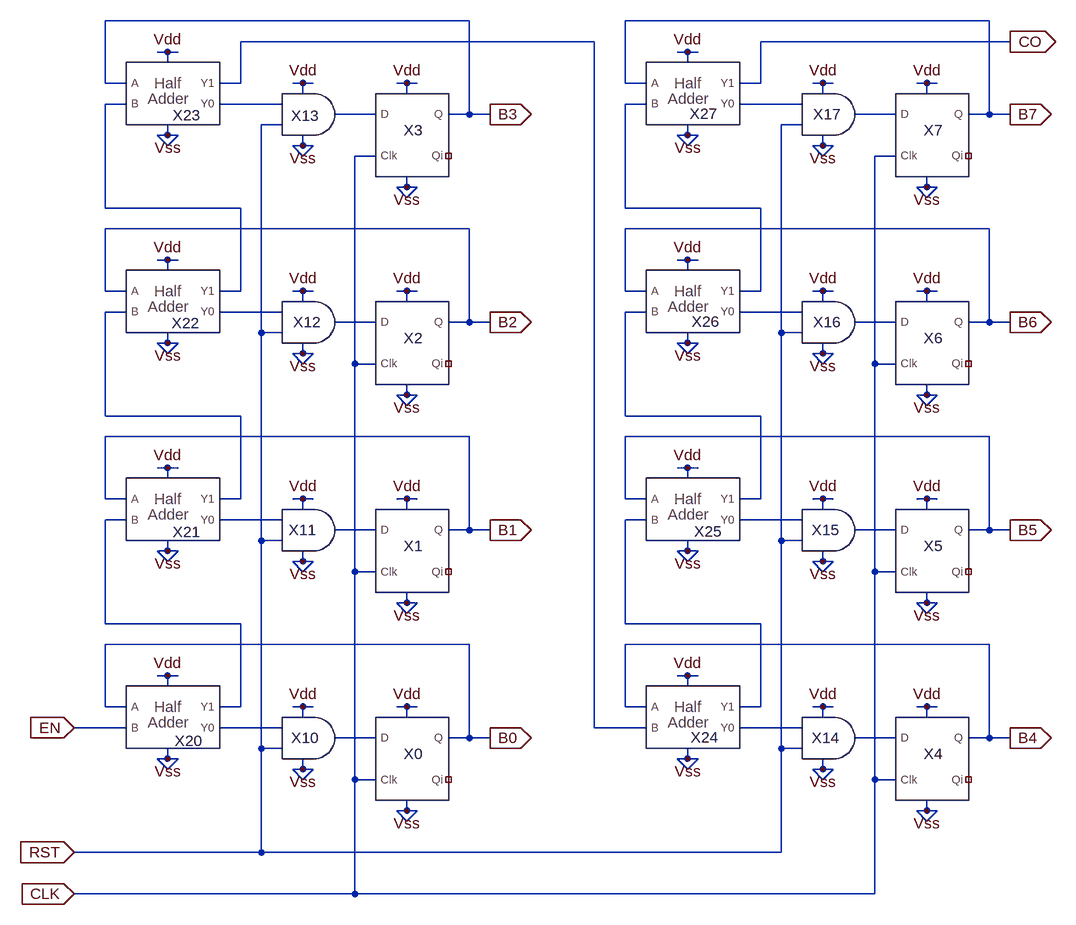
[diagram p0: schematic 8bitcounter.asc]
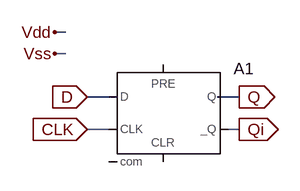
[diagram p1: sub-circuit dff.asc]
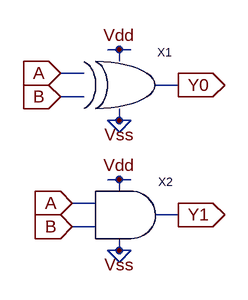
[diagram p2: sub-circuit halfadder.asc]
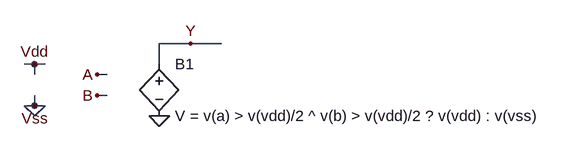
[diagram p3: sub-circuit xor.asc]
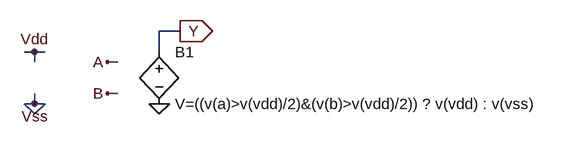
[diagram p4: sub-circuit and.asc]
8bitcounter.asc, the LTspice schematic file:
Version 4
SHEET 1 1380 680
WIRE 448 -960 -112 -960
WIRE 1248 -960 688 -960
WIRE 640 -928 96 -928
WIRE 1280 -928 896 -928
WIRE -16 -912 -32 -912
WIRE 0 -912 -16 -912
WIRE 784 -912 768 -912
WIRE 800 -912 784 -912
WIRE -16 -896 -16 -912
WIRE 784 -896 784 -912
WIRE -112 -864 -112 -960
WIRE -80 -864 -112 -864
WIRE 96 -864 96 -928
WIRE 96 -864 64 -864
WIRE 192 -864 176 -864
WIRE 208 -864 192 -864
WIRE 352 -864 336 -864
WIRE 368 -864 352 -864
WIRE 688 -864 688 -960
WIRE 720 -864 688 -864
WIRE 896 -864 896 -928
WIRE 896 -864 864 -864
WIRE 992 -864 976 -864
WIRE 1008 -864 992 -864
WIRE 1152 -864 1136 -864
WIRE 1168 -864 1152 -864
WIRE 192 -848 192 -864
WIRE 352 -848 352 -864
WIRE 992 -848 992 -864
WIRE 1152 -848 1152 -864
WIRE -80 -832 -112 -832
WIRE 160 -832 64 -832
WIRE 720 -832 688 -832
WIRE 960 -832 864 -832
WIRE 304 -816 240 -816
WIRE 448 -816 448 -960
WIRE 448 -816 416 -816
WIRE 480 -816 448 -816
WIRE 1104 -816 1040 -816
WIRE 1248 -816 1248 -960
WIRE 1248 -816 1216 -816
WIRE 1280 -816 1248 -816
WIRE 160 -800 128 -800
WIRE 960 -800 928 -800
WIRE -16 -784 -16 -800
WIRE -16 -784 -32 -784
WIRE 0 -784 -16 -784
WIRE 784 -784 784 -800
WIRE 784 -784 768 -784
WIRE 800 -784 784 -784
WIRE -16 -768 -32 -784
WIRE -16 -768 0 -784
WIRE 192 -768 192 -784
WIRE 192 -768 176 -768
WIRE 208 -768 192 -768
WIRE 784 -768 768 -784
WIRE 784 -768 800 -784
WIRE 992 -768 992 -784
WIRE 992 -768 976 -768
WIRE 1008 -768 992 -768
WIRE 192 -752 176 -768
WIRE 192 -752 208 -768
WIRE 304 -752 272 -752
WIRE 992 -752 976 -768
WIRE 992 -752 1008 -768
WIRE 1104 -752 1072 -752
WIRE 352 -704 352 -720
WIRE 352 -704 336 -704
WIRE 368 -704 352 -704
WIRE 1152 -704 1152 -720
WIRE 1152 -704 1136 -704
WIRE 1168 -704 1152 -704
WIRE 352 -688 336 -704
WIRE 352 -688 368 -704
WIRE 1152 -688 1136 -704
WIRE 1152 -688 1168 -704
WIRE -112 -672 -112 -832
WIRE 96 -672 -112 -672
WIRE 688 -672 688 -832
WIRE 896 -672 688 -672
WIRE 448 -640 -112 -640
WIRE 1248 -640 688 -640
WIRE -16 -592 -32 -592
WIRE 0 -592 -16 -592
WIRE 784 -592 768 -592
WIRE 800 -592 784 -592
WIRE -16 -576 -16 -592
WIRE 784 -576 784 -592
WIRE -112 -544 -112 -640
WIRE -80 -544 -112 -544
WIRE 96 -544 96 -672
WIRE 96 -544 64 -544
WIRE 192 -544 176 -544
WIRE 208 -544 192 -544
WIRE 352 -544 336 -544
WIRE 368 -544 352 -544
WIRE 688 -544 688 -640
WIRE 720 -544 688 -544
WIRE 896 -544 896 -672
WIRE 896 -544 864 -544
WIRE 992 -544 976 -544
WIRE 1008 -544 992 -544
WIRE 1152 -544 1136 -544
WIRE 1168 -544 1152 -544
WIRE 192 -528 192 -544
WIRE 352 -528 352 -544
WIRE 992 -528 992 -544
WIRE 1152 -528 1152 -544
WIRE -80 -512 -112 -512
WIRE 160 -512 64 -512
WIRE 720 -512 688 -512
WIRE 960 -512 864 -512
WIRE 304 -496 240 -496
WIRE 448 -496 448 -640
WIRE 448 -496 416 -496
WIRE 480 -496 448 -496
WIRE 1104 -496 1040 -496
WIRE 1248 -496 1248 -640
WIRE 1248 -496 1216 -496
WIRE 1280 -496 1248 -496
WIRE 128 -480 128 -800
WIRE 160 -480 128 -480
WIRE 928 -480 928 -800
WIRE 960 -480 928 -480
WIRE -16 -464 -16 -480
WIRE -16 -464 -32 -464
WIRE 0 -464 -16 -464
WIRE 784 -464 784 -480
WIRE 784 -464 768 -464
WIRE 800 -464 784 -464
WIRE -16 -448 -32 -464
WIRE -16 -448 0 -464
WIRE 192 -448 192 -464
WIRE 192 -448 176 -448
WIRE 208 -448 192 -448
WIRE 784 -448 768 -464
WIRE 784 -448 800 -464
WIRE 992 -448 992 -464
WIRE 992 -448 976 -448
WIRE 1008 -448 992 -448
WIRE 192 -432 176 -448
WIRE 192 -432 208 -448
WIRE 272 -432 272 -752
WIRE 304 -432 272 -432
WIRE 992 -432 976 -448
WIRE 992 -432 1008 -448
WIRE 1072 -432 1072 -752
WIRE 1104 -432 1072 -432
WIRE 352 -384 352 -400
WIRE 352 -384 336 -384
WIRE 368 -384 352 -384
WIRE 1152 -384 1152 -400
WIRE 1152 -384 1136 -384
WIRE 1168 -384 1152 -384
WIRE 352 -368 336 -384
WIRE 352 -368 368 -384
WIRE 1152 -368 1136 -384
WIRE 1152 -368 1168 -384
WIRE -112 -352 -112 -512
WIRE 96 -352 -112 -352
WIRE 688 -352 688 -512
WIRE 896 -352 688 -352
WIRE 448 -320 -112 -320
WIRE 1248 -320 688 -320
WIRE -16 -272 -32 -272
WIRE 0 -272 -16 -272
WIRE 784 -272 768 -272
WIRE 800 -272 784 -272
WIRE -16 -256 -16 -272
WIRE 784 -256 784 -272
WIRE -112 -224 -112 -320
WIRE -80 -224 -112 -224
WIRE 96 -224 96 -352
WIRE 96 -224 64 -224
WIRE 192 -224 176 -224
WIRE 208 -224 192 -224
WIRE 352 -224 336 -224
WIRE 368 -224 352 -224
WIRE 688 -224 688 -320
WIRE 720 -224 688 -224
WIRE 896 -224 896 -352
WIRE 896 -224 864 -224
WIRE 992 -224 976 -224
WIRE 1008 -224 992 -224
WIRE 1152 -224 1136 -224
WIRE 1168 -224 1152 -224
WIRE 192 -208 192 -224
WIRE 352 -208 352 -224
WIRE 992 -208 992 -224
WIRE 1152 -208 1152 -224
WIRE -80 -192 -112 -192
WIRE 160 -192 64 -192
WIRE 720 -192 688 -192
WIRE 960 -192 864 -192
WIRE 304 -176 240 -176
WIRE 448 -176 448 -320
WIRE 448 -176 416 -176
WIRE 480 -176 448 -176
WIRE 1104 -176 1040 -176
WIRE 1248 -176 1248 -320
WIRE 1248 -176 1216 -176
WIRE 1280 -176 1248 -176
WIRE 128 -160 128 -480
WIRE 160 -160 128 -160
WIRE 928 -160 928 -480
WIRE 960 -160 928 -160
WIRE -16 -144 -16 -160
WIRE -16 -144 -32 -144
WIRE 0 -144 -16 -144
WIRE 784 -144 784 -160
WIRE 784 -144 768 -144
WIRE 800 -144 784 -144
WIRE -16 -128 -32 -144
WIRE -16 -128 0 -144
WIRE 192 -128 192 -144
WIRE 192 -128 176 -128
WIRE 208 -128 192 -128
WIRE 784 -128 768 -144
WIRE 784 -128 800 -144
WIRE 992 -128 992 -144
WIRE 992 -128 976 -128
WIRE 1008 -128 992 -128
WIRE 192 -112 176 -128
WIRE 192 -112 208 -128
WIRE 272 -112 272 -432
WIRE 304 -112 272 -112
WIRE 992 -112 976 -128
WIRE 992 -112 1008 -128
WIRE 1072 -112 1072 -432
WIRE 1104 -112 1072 -112
WIRE 352 -64 352 -80
WIRE 352 -64 336 -64
WIRE 368 -64 352 -64
WIRE 1152 -64 1152 -80
WIRE 1152 -64 1136 -64
WIRE 1168 -64 1152 -64
WIRE 352 -48 336 -64
WIRE 352 -48 368 -64
WIRE 1152 -48 1136 -64
WIRE 1152 -48 1168 -64
WIRE -112 -32 -112 -192
WIRE 96 -32 -112 -32
WIRE 688 -32 688 -192
WIRE 896 -32 688 -32
WIRE 448 0 -112 0
WIRE 1248 0 688 0
WIRE -16 48 -32 48
WIRE 0 48 -16 48
WIRE 784 48 768 48
WIRE 800 48 784 48
WIRE -16 64 -16 48
WIRE 784 64 784 48
WIRE -112 96 -112 0
WIRE -80 96 -112 96
WIRE 96 96 96 -32
WIRE 96 96 64 96
WIRE 192 96 176 96
WIRE 208 96 192 96
WIRE 352 96 336 96
WIRE 368 96 352 96
WIRE 688 96 688 0
WIRE 720 96 688 96
WIRE 896 96 896 -32
WIRE 896 96 864 96
WIRE 992 96 976 96
WIRE 1008 96 992 96
WIRE 1152 96 1136 96
WIRE 1168 96 1152 96
WIRE 192 112 192 96
WIRE 352 112 352 96
WIRE 992 112 992 96
WIRE 1152 112 1152 96
WIRE -80 128 -160 128
WIRE 160 128 64 128
WIRE 640 128 640 -928
WIRE 720 128 640 128
WIRE 960 128 864 128
WIRE 304 144 240 144
WIRE 448 144 448 0
WIRE 448 144 416 144
WIRE 480 144 448 144
WIRE 1104 144 1040 144
WIRE 1248 144 1248 0
WIRE 1248 144 1216 144
WIRE 1280 144 1248 144
WIRE 128 160 128 -160
WIRE 160 160 128 160
WIRE 928 160 928 -160
WIRE 960 160 928 160
WIRE -16 176 -16 160
WIRE -16 176 -32 176
WIRE 0 176 -16 176
WIRE 784 176 784 160
WIRE 784 176 768 176
WIRE 800 176 784 176
WIRE -16 192 -32 176
WIRE -16 192 0 176
WIRE 192 192 192 176
WIRE 192 192 176 192
WIRE 208 192 192 192
WIRE 784 192 768 176
WIRE 784 192 800 176
WIRE 992 192 992 176
WIRE 992 192 976 192
WIRE 1008 192 992 192
WIRE 192 208 176 192
WIRE 192 208 208 192
WIRE 272 208 272 -112
WIRE 304 208 272 208
WIRE 992 208 976 192
WIRE 992 208 1008 192
WIRE 1072 208 1072 -112
WIRE 1104 208 1072 208
WIRE 352 256 352 240
WIRE 352 256 336 256
WIRE 368 256 352 256
WIRE 1152 256 1152 240
WIRE 1152 256 1136 256
WIRE 1168 256 1152 256
WIRE 352 272 336 256
WIRE 352 272 368 256
WIRE 1152 272 1136 256
WIRE 1152 272 1168 256
WIRE 128 320 128 160
WIRE 128 320 -160 320
WIRE 928 320 928 160
WIRE 928 320 128 320
WIRE 272 384 272 208
WIRE 272 384 -160 384
WIRE 1072 384 1072 208
WIRE 1072 384 272 384
FLAG 352 96 Vdd
FLAG 352 256 Vss
FLAG 192 96 Vdd
FLAG -16 48 Vdd
FLAG 192 192 Vss
FLAG -16 176 Vss
FLAG 480 144 B0
IOPIN 480 144 Out
FLAG 352 -224 Vdd
FLAG 352 -64 Vss
FLAG 192 -224 Vdd
FLAG -16 -272 Vdd
FLAG 192 -128 Vss
FLAG -16 -144 Vss
FLAG 480 -176 B1
IOPIN 480 -176 Out
FLAG 352 -544 Vdd
FLAG 352 -384 Vss
FLAG 192 -544 Vdd
FLAG -16 -592 Vdd
FLAG 192 -448 Vss
FLAG -16 -464 Vss
FLAG 480 -496 B2
IOPIN 480 -496 Out
FLAG 352 -864 Vdd
FLAG 352 -704 Vss
FLAG 192 -864 Vdd
FLAG -16 -912 Vdd
FLAG 192 -768 Vss
FLAG -16 -784 Vss
FLAG 480 -816 B3
IOPIN 480 -816 Out
FLAG -160 128 EN
IOPIN -160 128 In
FLAG -160 320 RST
IOPIN -160 320 In
FLAG -160 384 CLK
IOPIN -160 384 In
FLAG 1152 96 Vdd
FLAG 1152 256 Vss
FLAG 992 96 Vdd
FLAG 784 48 Vdd
FLAG 992 192 Vss
FLAG 784 176 Vss
FLAG 1280 144 B4
IOPIN 1280 144 Out
FLAG 1152 -224 Vdd
FLAG 1152 -64 Vss
FLAG 992 -224 Vdd
FLAG 784 -272 Vdd
FLAG 992 -128 Vss
FLAG 784 -144 Vss
FLAG 1280 -176 B5
IOPIN 1280 -176 Out
FLAG 1152 -544 Vdd
FLAG 1152 -384 Vss
FLAG 992 -544 Vdd
FLAG 784 -592 Vdd
FLAG 992 -448 Vss
FLAG 784 -464 Vss
FLAG 1280 -496 B6
IOPIN 1280 -496 Out
FLAG 1152 -864 Vdd
FLAG 1152 -704 Vss
FLAG 992 -864 Vdd
FLAG 784 -912 Vdd
FLAG 992 -768 Vss
FLAG 784 -784 Vss
FLAG 1280 -816 B7
IOPIN 1280 -816 Out
FLAG 1280 -928 CO
IOPIN 1280 -928 Out
SYMBOL dff 304 240 R0
SYMATTR InstName X0
SYMBOL halfadder -80 160 R0
WINDOW 0 75 -12 Left 0
SYMATTR InstName X20
SYMBOL and 160 144 R0
WINDOW 0 14 0 Left 0
SYMATTR InstName X10
SYMBOL dff 304 -80 R0
SYMATTR InstName X1
SYMBOL halfadder -80 -160 R0
WINDOW 0 72 -13 Left 0
SYMATTR InstName X21
SYMBOL and 160 -176 R0
WINDOW 0 10 0 Left 0
SYMATTR InstName X11
SYMBOL dff 304 -400 R0
SYMATTR InstName X2
SYMBOL halfadder -80 -480 R0
WINDOW 0 70 -15 Left 0
SYMATTR InstName X22
SYMBOL and 160 -496 R0
WINDOW 0 17 0 Left 0
SYMATTR InstName X12
SYMBOL dff 304 -720 R0
SYMATTR InstName X3
SYMBOL halfadder -80 -800 R0
WINDOW 0 72 -15 Left 0
SYMATTR InstName X23
SYMBOL and 160 -816 R0
WINDOW 0 14 2 Left 0
SYMATTR InstName X13
SYMBOL dff 1104 240 R0
SYMATTR InstName X4
SYMBOL halfadder 720 160 R0
WINDOW 0 69 -17 Left 0
SYMATTR InstName X24
SYMBOL and 960 144 R0
WINDOW 0 15 0 Left 0
SYMATTR InstName X14
SYMBOL dff 1104 -80 R0
SYMATTR InstName X5
SYMBOL halfadder 720 -160 R0
WINDOW 0 74 -14 Left 0
SYMATTR InstName X25
SYMBOL and 960 -176 R0
WINDOW 0 15 0 Left 0
SYMATTR InstName X15
SYMBOL dff 1104 -400 R0
SYMATTR InstName X6
SYMBOL halfadder 720 -480 R0
WINDOW 0 70 -17 Left 0
SYMATTR InstName X26
SYMBOL and 960 -496 R0
WINDOW 0 17 0 Left 0
SYMATTR InstName X16
SYMBOL dff 1104 -720 R0
SYMATTR InstName X7
SYMBOL halfadder 720 -800 R0
WINDOW 0 67 -17 Left 0
SYMATTR InstName X27
SYMBOL and 960 -816 R0
WINDOW 0 17 0 Left 0
SYMATTR InstName X17

dff.asc, the sub-circuit schematic file:
Version 4
SHEET 1 880 680
WIRE 64 32 48 32
WIRE 64 64 48 64
WIRE 128 128 96 128
WIRE 320 128 288 128
WIRE 128 176 96 176
WIRE 320 176 304 176
FLAG 96 128 D
IOPIN 96 128 In
FLAG 96 176 CLK
IOPIN 96 176 In
FLAG 320 128 Q
IOPIN 320 128 Out
FLAG 320 176 Qi
IOPIN 320 176 Out
FLAG 48 32 Vdd
FLAG 48 64 Vss
SYMBOL Digital\\dflop 208 80 R0
SYMATTR InstName A1
SYMATTR SpiceLine vhigh=5 tau=1n

halfadder.asc, the sub-circuit schematic file:
Version 4
SHEET 1 880 680
WIRE 96 240 80 240
WIRE 112 240 96 240
WIRE 96 256 96 240
WIRE 48 272 16 272
WIRE 176 288 144 288
WIRE 48 304 16 304
WIRE 96 336 96 320
WIRE 96 336 80 336
WIRE 112 336 96 336
WIRE 96 352 80 336
WIRE 96 352 112 336
WIRE 96 416 80 416
WIRE 112 416 96 416
WIRE 96 432 96 416
WIRE 64 448 32 448
WIRE 176 464 144 464
WIRE 64 480 32 480
WIRE 96 512 96 496
WIRE 96 512 80 512
WIRE 112 512 96 512
WIRE 96 528 80 512
WIRE 96 528 112 512
FLAG 16 272 A
IOPIN 16 272 In
FLAG 16 304 B
IOPIN 16 304 In
FLAG 176 288 Y0
IOPIN 176 288 Out
FLAG 96 240 Vdd
FLAG 96 336 Vss
FLAG 96 416 Vdd
FLAG 96 512 Vss
FLAG 32 448 A
IOPIN 32 448 In
FLAG 32 480 B
IOPIN 32 480 In
FLAG 176 464 Y1
IOPIN 176 464 Out
SYMBOL xor 48 288 R0
SYMATTR InstName X1
SYMBOL and 64 464 R0
SYMATTR InstName X2

xor.asc, the sub-circuit schematic file:
Version 4
SHEET 1 1264 952
WIRE 592 448 544 448
WIRE 640 448 592 448
WIRE 352 480 336 480
WIRE 368 480 352 480
WIRE 544 480 544 448
WIRE 352 496 352 480
WIRE 464 496 448 496
WIRE 464 528 448 528
WIRE 352 544 352 528
WIRE 352 544 336 544
WIRE 368 544 352 544
WIRE 352 560 336 544
WIRE 352 560 368 544
FLAG 448 496 A
FLAG 448 528 B
FLAG 352 480 Vdd
FLAG 352 544 Vss
FLAG 544 560 0
FLAG 592 448 Y
SYMBOL bv 544 464 R0
SYMATTR InstName B1
SYMATTR Value V = v(a) > v(vdd)/2 ^ v(b) > v(vdd)/2 ? v(vdd) : v(vss)

and.asc, the sub-circuit schematic file:
Version 4
SHEET 1 1192 680
WIRE 560 80 528 80
WIRE 336 112 320 112
WIRE 352 112 336 112
WIRE 528 112 528 80
WIRE 336 128 336 112
WIRE 464 128 448 128
WIRE 464 176 448 176
WIRE 336 192 336 176
WIRE 336 192 320 192
WIRE 352 192 336 192
WIRE 336 208 320 192
WIRE 336 208 352 192
FLAG 448 128 A
FLAG 448 176 B
FLAG 336 112 Vdd
FLAG 560 80 Y
IOPIN 560 80 Out
FLAG 336 192 Vss
FLAG 528 192 0
SYMBOL bv 528 96 R0
SYMATTR InstName B1
SYMATTR Value V=((v(a)>v(vdd)/2)&(v(b)>v(vdd)/2)) ? v(vdd) : v(vss)

The netlist it stands for:
* 8bitcounter.asc
XX0 N022 CLK B0 NC_01 Vdd Vss dff
XX20 B0 EN N020 N014 Vdd Vss halfadder
XX10 N020 RST N022 Vdd Vss and
XX1 N018 CLK B1 NC_02 Vdd Vss dff
XX21 B1 N014 N015 N008 Vdd Vss halfadder
XX11 N015 RST N018 Vdd Vss and
XX2 N012 CLK B2 NC_03 Vdd Vss dff
XX22 B2 N008 N009 N002 Vdd Vss halfadder
XX12 N009 RST N012 Vdd Vss and
XX3 N006 CLK B3 NC_04 Vdd Vss dff
XX23 B3 N002 N003 N001 Vdd Vss halfadder
XX13 N003 RST N006 Vdd Vss and
XX4 N023 CLK B4 NC_05 Vdd Vss dff
XX24 B4 N001 N021 N016 Vdd Vss halfadder
XX14 N021 RST N023 Vdd Vss and
XX5 N019 CLK B5 NC_06 Vdd Vss dff
XX25 B5 N016 N017 N010 Vdd Vss halfadder
XX15 N017 RST N019 Vdd Vss and
XX6 N013 CLK B6 NC_07 Vdd Vss dff
XX26 B6 N010 N011 N004 Vdd Vss halfadder
XX16 N011 RST N013 Vdd Vss and
XX7 N007 CLK B7 NC_08 Vdd Vss dff
XX27 B7 N004 N005 CO Vdd Vss halfadder
XX17 N005 RST N007 Vdd Vss and

* block symbol definitions
.subckt dff D Clk Q Qi VDD Vss
A1 D 0 CLK 0 0 Qi Q 0 DFLOP vhigh=5 tau=1n
.ends dff

.subckt halfadder A B Y0 Y1 Vdd Vss
XX1 A B Y0 Vdd Vss xor
XX2 A B Y1 Vdd Vss and
.ends halfadder

.subckt xor A B Y Vdd Vss
B1 Y 0 V = v(a) > v(vdd)/2 ^ v(b) > v(vdd)/2 ? v(vdd) : v(vss)
.ends xor

.subckt and A B Y Vdd Vss
B1 Y 0 V=((v(a)>v(vdd)/2)&(v(b)>v(vdd)/2)) ? v(vdd) : v(vss)
.ends and

.backanno
.end